# EAGLE schematic LED MATRIX PTH (EAGLE 9.2.2)
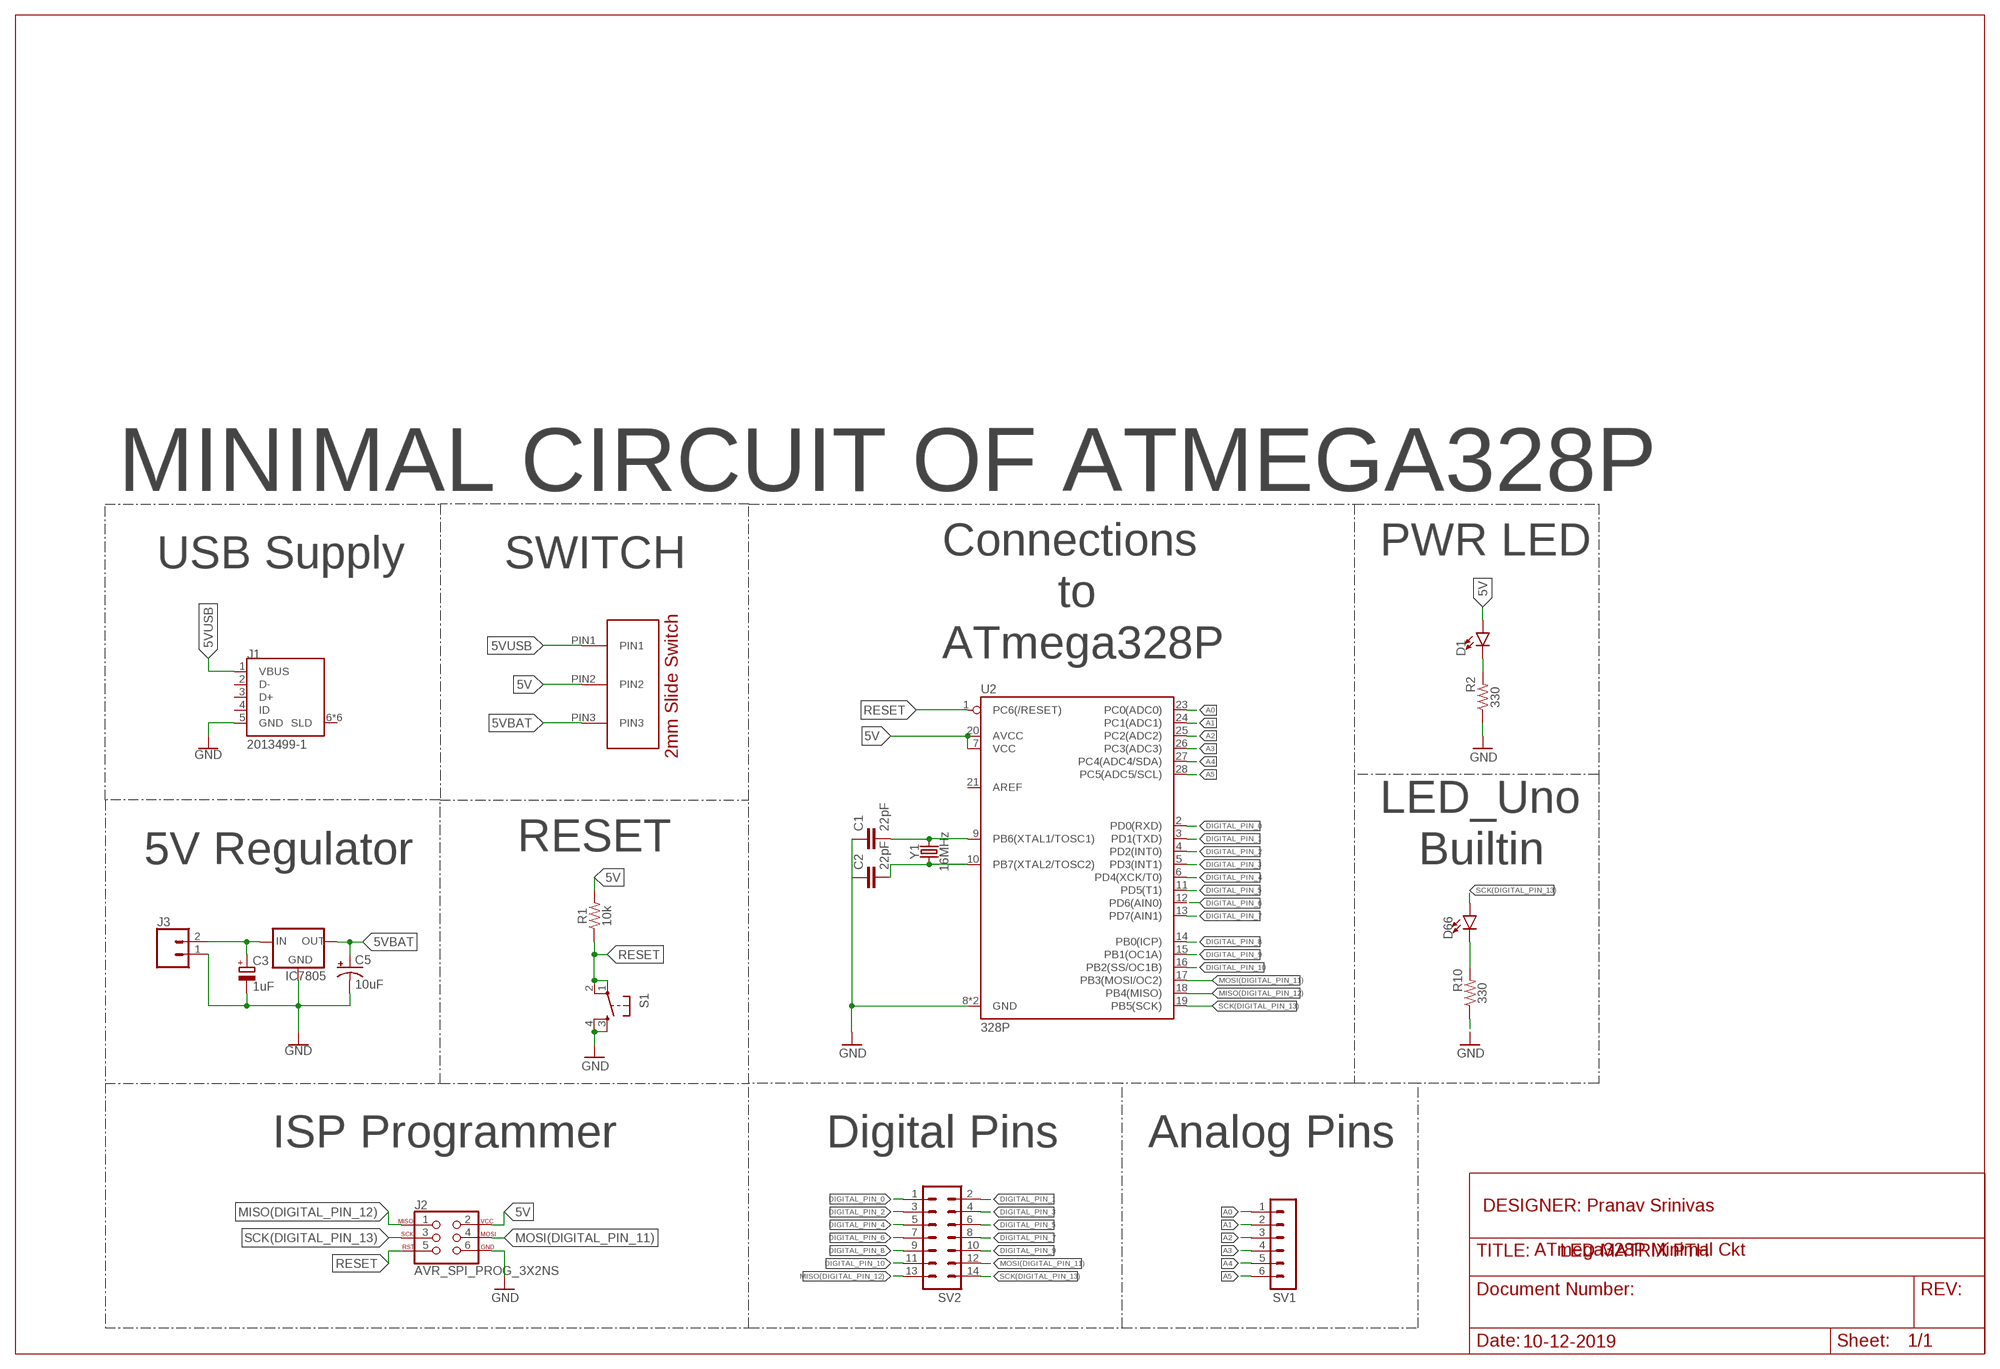
[diagram p0: schematic, sheet 1]

## Parts
C1  22pF  22PF-0603-50V-5%  [0603]
C2  22pF  22PF-0603-50V-5%  [0603]
C3  1uF  CPOL-EUSMCA  [SMC_A]
C5  10uF  10UF-POLAR-EIA3216-16V-10%(TANT)  [EIA3216]
D1  LED0603  [LED-0603]
D66  LED0603  [LED-0603]
IC7805  V_REG_78XX-TO-220  [TO-220-ALT]
J1  2013499-1  [TE_2013499-1]
J2  AVR_SPI_PROG_3X2NS  [2X3-NS]
J3  CONN_02  [1X02]
R1  10k  10KOHM-0603-1/10W-1%  [0603]
R2  330  330OHM-0603-1/10W-1%  [0603]
R10  330  330OHM-0603-1/10W-1%  [0603]
S1  TAC_SWITCHSMD  [TACTILE_SWITCH_SMD]
SV1  MA06-1  [MA06-1]
SV2  MA07-2  [MA07-2]
U2  328P  ATMEGA328P_PDIP  [DIP28]
U$1  2MMS_SLIDE_SWITCH  [2MMS_SLIDE_SWITCH]
Y1  16MHz  CRYSTAL-16MHZPTH-HC49US  [HC49US]

## Nets
5V: D1.A J2.2 R1.2 U2.7(VCC) U2.20(AVCC) U$1.PIN2
5VBAT: C5.+ IC7805.OUT U$1.PIN3
5VUSB: J1.1(VBUS) U$1.PIN1
A0: SV1.1 U2.23(PC0(ADC0))
A1: SV1.2 U2.24(PC1(ADC1))
A2: SV1.3 U2.25(PC2(ADC2))
A3: SV1.4 U2.26(PC3(ADC3))
A4: SV1.5 U2.27(PC4(ADC4/SDA))
A5: SV1.6 U2.28(PC5(ADC5/SCL))
DIGITAL_PIN_0: SV2.1 U2.2(PD0(RXD))
DIGITAL_PIN_1: SV2.2 U2.3(PD1(TXD))
DIGITAL_PIN_2: SV2.3 U2.4(PD2(INT0))
DIGITAL_PIN_3: SV2.4 U2.5(PD3(INT1))
DIGITAL_PIN_4: SV2.5 U2.6(PD4(XCK/T0))
DIGITAL_PIN_5: SV2.6 U2.11(PD5(T1))
DIGITAL_PIN_6: SV2.7 U2.12(PD6(AIN0))
DIGITAL_PIN_7: SV2.8 U2.13(PD7(AIN1))
DIGITAL_PIN_8: SV2.9 U2.14(PB0(ICP))
DIGITAL_PIN_9: SV2.10 U2.15(PB1(OC1A))
DIGITAL_PIN_10: SV2.11 U2.16(PB2(SS/OC1B))
GND: C1.1 C2.1 C3.- C5.- IC7805.GND J1.5(GND) J2.6 J3.1 R2.1 R10.1 S1.3 S1.4 U2.8(GND) U2.22(GND)
MISO(DIGITAL_PIN_12): J2.1 SV2.13 U2.18(PB4(MISO))
MOSI(DIGITAL_PIN_11): J2.4 SV2.12 U2.17(PB3(MOSI/OC2))
N$1: C1.2 U2.9(PB6(XTAL1/TOSC1)) Y1.2
N$2: C2.2 U2.10(PB7(XTAL2/TOSC2)) Y1.1
N$3: C3.+ IC7805.IN J3.2
N$5: D66.C R10.2
N$7: D1.C R2.2
RESET: J2.5 R1.1 S1.1 S1.2 U2.1(PC6(/RESET))
SCK(DIGITAL_PIN_13): D66.A J2.3 SV2.14 U2.19(PB5(SCK))
Unconnected: J1.2(D-) J1.3(D+) J1.4(ID) J1.6(SLD) J1.7(SLD) J1.8(SLD) J1.9(SLD) J1.10(SLD) J1.11(SLD) U2.21(AREF)

## Notes on the sheet
- MINIMAL CIRCUIT OF ATMEGA328P
- USB Supply | SWITCH | Connections | PWR LED
- to
- ATmega328P
- LED_Uno
- 5V Regulator | RESET | Builtin
- ISP Programmer | Digital Pins | Analog Pins
- DESIGNER: Pranav Srinivas
- ATmega328P Minimal Ckt
- 10-12-2019

## Library data of the parts
C1 C2 = SparkFun-Capacitors:22PF: 22pF ceramic capacitors A capacitor is a passive two-terminal electrical component used to store electrical energy temporarily in an electric field.; PROD_ID: CAP-07876
C3 = resistor:CPOL-EU: POLARIZED CAPACITOR, European symbol
C5 = SparkFun-Capacitors:10UF-POLAR: 10.0µF polarized capacitors A capacitor is a passive two-terminal electrical component used to store electrical energy temporarily in an electric field.; PROD_ID: CAP-00811
D1 D66 = SparkFun-LED:LED: LED (Generic) Standard schematic elements and footprints for 5mm, 3mm, 1206, and 0603 sized LEDs. Generic LEDs with no color specified.
IC7805 = SparkFun-IC-Power:V_REG_78XX: Voltage Regulator Standard 78xx regulator. IGO (Input Ground Output). Spark Fun Electronics SKU : COM-00107; PROD_ID: VREG-08450; SF_ID: COM-00107
J1 = 2013499-1:2013499-1: CONN PCB USB 5POS; AVAILABILITY: Unavailable; COMMENT: 2013499-1; DESCRIPTION: Conn Micro USB Type B RCP 5 POS 0.65mm Solder RA SMD 5 Terminal 1 Port T/R; MF: TE Connectivity; MP: 2013499-1; PACKAGE: None; PRICE: None; TE_PURCHASE_URL: https://www.te.com/usa-en/product-2013499-1.html?te_bu=Cor&te_type=disp&te_campaign=seda_glo_cor-seda-global-disp-prtnr-fy19-seda-model-bom-cta_sma-317_1&elqCampaignId=32493
J2 = SparkFun-Connectors:AVR_SPI_PROG_3X2: AVR ISP 6 Pin This is the reduced ISP connector for AVR programming. Common on Arduino. This footprint will take up less PCB space and can be used with a 10-pin to 6-pin adapter such as SKU: BOB-08508 **Special note about "TEST_POINT" package. The stop mask is on the top side, so if you want your programming test points to be on the bottom of your board, make sure to place this package on the bottom side of the board. This also ensure that the orientation to program from the bottom side will be correct. SparkFun Products: SparkFun ISP Pogo Adapter <https://www.sparkfun.com/products/11591> - NS Tiny AVR Programmer <https://www.sparkfun.com/products/11801> -PTH
J3 = SparkFun-Connectors:CONN_02: Multi connection point. Often used as Generic Header-pin footprint for 0.1 inch spaced/style header connections On any of the 0.1 inch spaced packages, you can populate with these: Break Away Headers - Straight <https://www.sparkfun.com/products/116> (PRT-00116) Break Away Male Headers - Right Angle <https://www.sparkfun.com/products/553> (PRT-00553) Female Headers <https://www.sparkfun.com/products/115> (PRT-00115) Break Away Headers - Machine Pin <https://www.sparkfun.com/products/117> (PRT-00117) Break Away Female Headers - Swiss Machine Pin <https://www.sparkfun.com/products/743> (PRT-00743) For SCREWTERMINALS and SPRING TERMINALS visit here: Screw Terimnals on SparkFun.com <https://www.sparkfun.com/search/results?term=Screw+Terminals> (5mm/3.5mm/2.54mm spacing) This device is also useful as a general connection point to wire up your design to another part of your project. Our various solder wires solder well into these plated through hole pads. Hook-Up Wire - Assortment (Stranded, 22 AWG) <https://www.sparkfun.com/products/11375> (PRT-11375) Hook-Up Wire - Assortment (Solid Core, 22 AWG) <https://www.sparkfun.com/products/11367> (PRT-11367) View the entire wire category on our website here <https://www.sparkfun.com/categories/141> Special notes: Molex polarized connector foot print use with: PRT-08233 with associated crimp pins and housings. 2.54_SCREWTERM for use with PRT-10571. 3.5mm Screw Terminal footprints for PRT-08084 5mm Screw Terminal footprints for use with PRT-08432
R1 = SparkFun-Resistors:10KOHM: 10kΩ resistor A resistor is a passive two-terminal electrical component that implements electrical resistance as a circuit element. Resistors act to reduce current flow, and, at the same time, act to lower voltage levels within circuits. - Wikipedia; PROD_ID: RES-00824
R2 R10 = SparkFun-Resistors:330OHM: 330Ω resistor A resistor is a passive two-terminal electrical component that implements electrical resistance as a circuit element. Resistors act to reduce current flow, and, at the same time, act to lower voltage levels within circuits. - Wikipedia; PROD_ID: RES-00818
S1 = SparkFun:TAC_SWITCH: Momentary Switch Button commonly used for reset or general input. Spark Fun Electronics SKU : COM-00097
SV1 = con-lstb:MA06-1: PIN HEADER; OC_FARNELL: unknown; OC_NEWARK: unknown
SV2 = con-lstb:MA07-2: PIN HEADER; OC_FARNELL: unknown; OC_NEWARK: unknown
U2 = SparkFun-IC-Microcontroller:ATMEGA328P_PDIP: Atmel 328P Through hole ATMEGA328P uC used in the Arduino 32kb flash, 1k EEPROM, 2k SRAM Datasheet <http://www.sparkfun.com/datasheets/Components/SMD/ATMega328.pdf> SparkFun Products Storefront component: AVR 28 Pin 20MHz 32K 6A/D - ATMega328P <https://www.sparkfun.com/products/9061> (COM-09061) SparkFun Simon Says - Through-Hole Soldering Kit <https://www.sparkfun.com/products/10547> (KIT-10547) SparkFun Learn to Solder - Simon Says <https://www.sparkfun.com/products/13708> (KIT-13708) SparkFun BigTime Watch Kit <https://www.sparkfun.com/products/11734> (KIT-11734) SparkFun ClockIt <https://www.sparkfun.com/products/10930> (KIT-10930) SparkFun Serial Enabled LCD Kit <https://www.sparkfun.com/products/10097> (LCD-10097) SparkFun Simon Tilts - Through Hole Soldering Kit <https://www.sparkfun.com/products/12634> (KIT-12634) SparkFun Frequency Counter Kit <https://www.sparkfun.com/products/10140> (KIT-10140) FabFM Radio Kit <https://www.sparkfun.com/products/11043> (KIT-11043) SparkFun Binary Blaster Kit <https://www.sparkfun.com/products/12037> (KIT-12037) SparkFun Metro-Gnome <https://www.sparkfun.com/products/9236> (KIT-09236) ATmega328 with Arduino Optiboot (Uno) <https://www.sparkfun.com/products/10524> (DEV-10524); PROD_ID: IC-09136
U$1 = 2MMS_SLIDE_SWITCH:2MMS_SLIDE_SWITCH
Y1 = SparkFun-Clocks:CRYSTAL-16MHZ: 16MHz Crystal Digikey Example <http://www.digikey.com/product-search/en?keywords=535-9122-1-ND> Frequency: 16MHz Frequency Stability: ±50ppm Frequency Tolerance: ±20ppm Load Capacitance: 18pF SparkFun Products: Pro Micro -5V/16MHz <https://www.sparkfun.com/products/12640> SparkFun Serial Enabled LCD Kit <https://www.sparkfun.com/products/10097>; PROD_ID: XTAL-08181; SF_ID: COM-00536